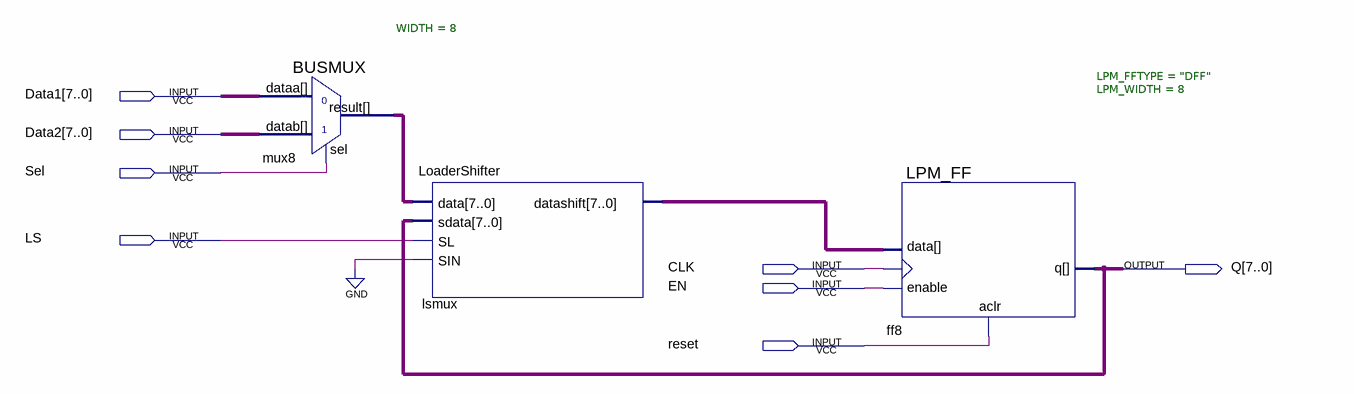
[diagram p0: schematic sheet]
// Quartus schematic Register.bdf as structural Verilog: 3 symbols, 8 pins
module Register (
  input  [7:0] Data1,
  input  [7:0] Data2,
  input  Sel,
  input  LS,
  input  CLK,
  input  EN,
  input  reset,
  output [7:0] Q
);

  wire [7:0] lsmux_datashift, mux8_result;

  BUSMUX #(.WIDTH(8)) mux8 (.datab(Data2), .sel(Sel), .dataa(Data1), .result(mux8_result));
  LoaderShifter lsmux (.sdata(Q), .data(mux8_result), .SL(LS), .SIN(1'b0), .datashift(lsmux_datashift));
  LPM_FF #(.LPM_FFTYPE("DFF"), .LPM_WIDTH(8)) ff8 (
    .aclr(reset), .clock(CLK), .data(lsmux_datashift), .enable(EN), .q(Q));
endmodule
